# EAGLE design asomator5 (EAGLE 7.7.0)
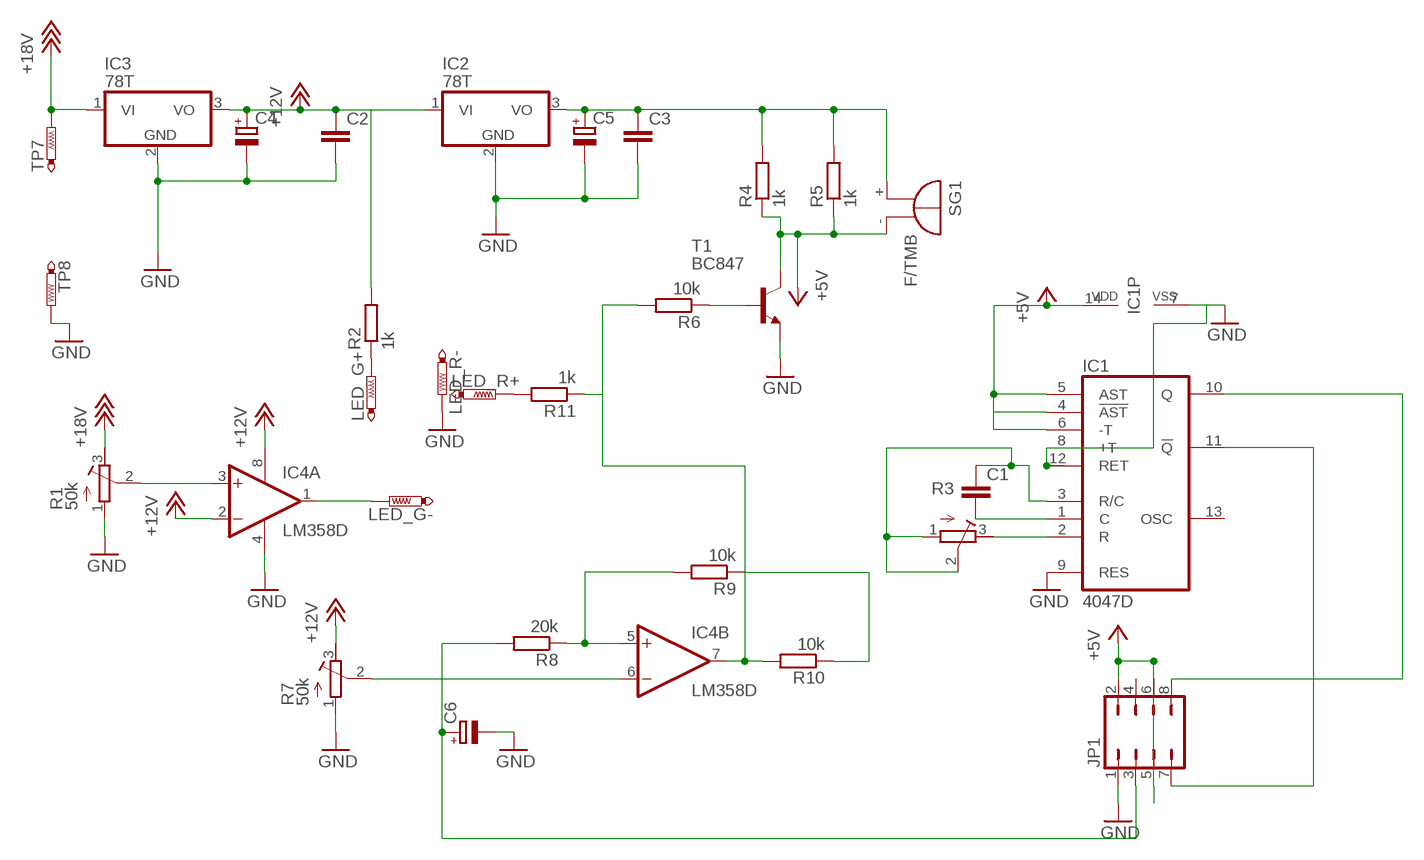
[diagram p0: schematic, sheet 1]

## Parts
C1  C-EUC1210  [C1210]
C2  C-EUC1210  [C1210]
C3  C-EUC1210  [C1210]
C4  CPOL-EUE2.5-7  [E2,5-7]
C5  CPOL-EUE2.5-7  [E2,5-7]
C6  CPOL-EUE2.5-7  [E2,5-7]
IC1  4047D  [SO14]
IC2  78T  7805T  [TO220H]
IC3  78T  7812T  [TO220H]
IC4  LM358D  [SO08]
JP1  JP4Q  [JP4Q]
LED_G+  PTR1PAD1-13Y  [P1-13Y]
LED_G-  PTR1PAD1-13Y  [P1-13Y]
LED_R+  PTR1PAD1-13Y  [P1-13Y]
LED_R-  PTR1PAD1-13Y  [P1-13Y]
R1  50k  R-TRIMM64W  [RTRIM64W]
R2  1k  R-EU_R1206  [R1206]
R3  R-TRIMM4G/J  [RTRIM4G/J]
R4  1k  R-EU_R1206  [R1206]
R5  1k  R-EU_R1206  [R1206]
R6  10k  R-EU_R1206  [R1206]
R7  50k  R-TRIMM64W  [RTRIM64W]
R8  20k  R-EU_R1206  [R1206]
R9  10k  R-EU_R1206  [R1206]
R10  10k  R-EU_R1206  [R1206]
R11  1k  R-EU_R1206  [R1206]
SG1  F/TMB  [F/TMB]
T1  BC847  [SOT23]
TP7  PTR1PAD1-13Y  [P1-13Y]
TP8  PTR1PAD1-13Y  [P1-13Y]

## Nets
+5V: IC1.4(!AST) IC1.5(AST) IC1.6(-T) IC1.14(VDD) JP1.2 JP1.5 JP1.6 R4.1 R5.1 SG1.- T1.3(C)
+12V: C2.1 C4.+ IC2.1(VI) IC3.3(VO) IC4.2(A:-IN) IC4.8(P:V+) R2.2 R7.3(E)
+18V: IC3.1(VI) R1.3(E) TP7.TP
GND: C2.2 C3.2 C4.- C5.- C6.- IC1.7(VSS) IC1.8(+T) IC1.9(RES) IC1.12(RET) IC2.2(GND) IC3.2(GND) IC4.4(P:V-) JP1.1 LED_R-.TP R1.1(A) R7.1(A) T1.2(E) TP8.TP
N$2: LED_G+.TP R2.1
N$3: LED_R+.TP R11.2
N$4: IC4.1(A:OUT) LED_G-.TP
N$5: IC4.3(A:+IN) R1.2(S)
N$6: IC4.7(B:OUT) R6.2 R10.2 R11.1
N$7: IC1.2(R) R3.3(E)
N$8: C1.2 IC1.1(C)
N$9: C1.1 IC1.3(R/C) R3.1(A) R3.2(S)
N$10: C3.1 C5.+ IC2.3(VO) R4.2 R5.2 SG1.+
N$12: IC1.10(Q) JP1.8
N$13: IC4.5(B:+IN) R8.1 R9.2
N$14: R9.1 R10.1
N$15: IC4.6(B:-IN) R7.2(S)
N$16: IC1.11(!Q) JP1.7
N$17: C6.+ JP1.3 R8.2
N$18: R6.1 T1.1(B)
Unconnected: IC1.13(OSC) JP1.4

## Library data of the parts
C1-C3 = rcl:C-EU: CAPACITOR, European symbol
C4-C6 = rcl:CPOL-EU: POLARIZED CAPACITOR, European symbol
IC1 = 40xx:4047: LP monostable/astable MULTIVIBRATOR
IC2 IC3 = linear:78*: Positive VOLTAGE REGULATOR Source: http://cache.national.com/ds/LM/LM78L05.pdf http://www.fairchildsemi.com/ds/LM/LM7805.pdf
IC4 = linear:LM358: OP AMP also LM158; LM258; LM2904 Source: http://cache.national.com/ds/LM/LM158.pdf
JP1 = jumper:JP4Q: JUMPER
LED_G+ LED_G- LED_R+ LED_R- TP7 TP8 = testpad:PTR1: TEST PIN
R1 R3 R7 = rcl:R-TRIMM: Trimm resistor
R2 R4-R6 R8-R11 = rcl:R-EU_: RESISTOR, European symbol
SG1 = buzzer:F/TMB: BUZZER Source: Buerklin; OC_FARNELL: unknown; OC_NEWARK: unknown
T1 = transistor:BC847: NPN TRANSISTOR

## Board
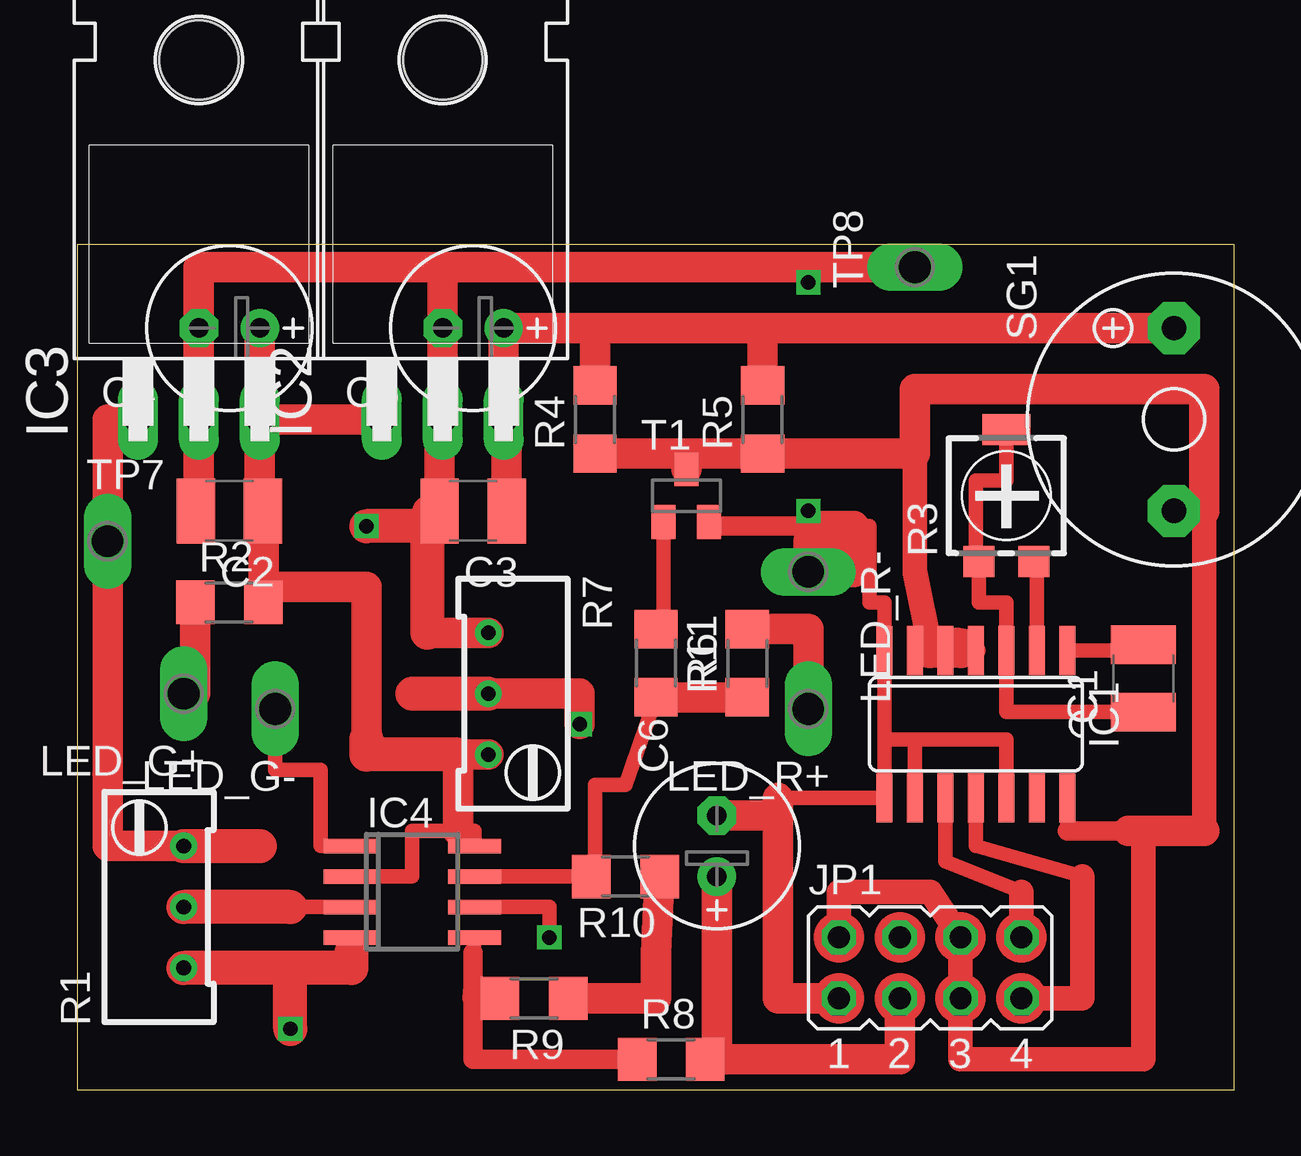
[diagram p1: board, top side]
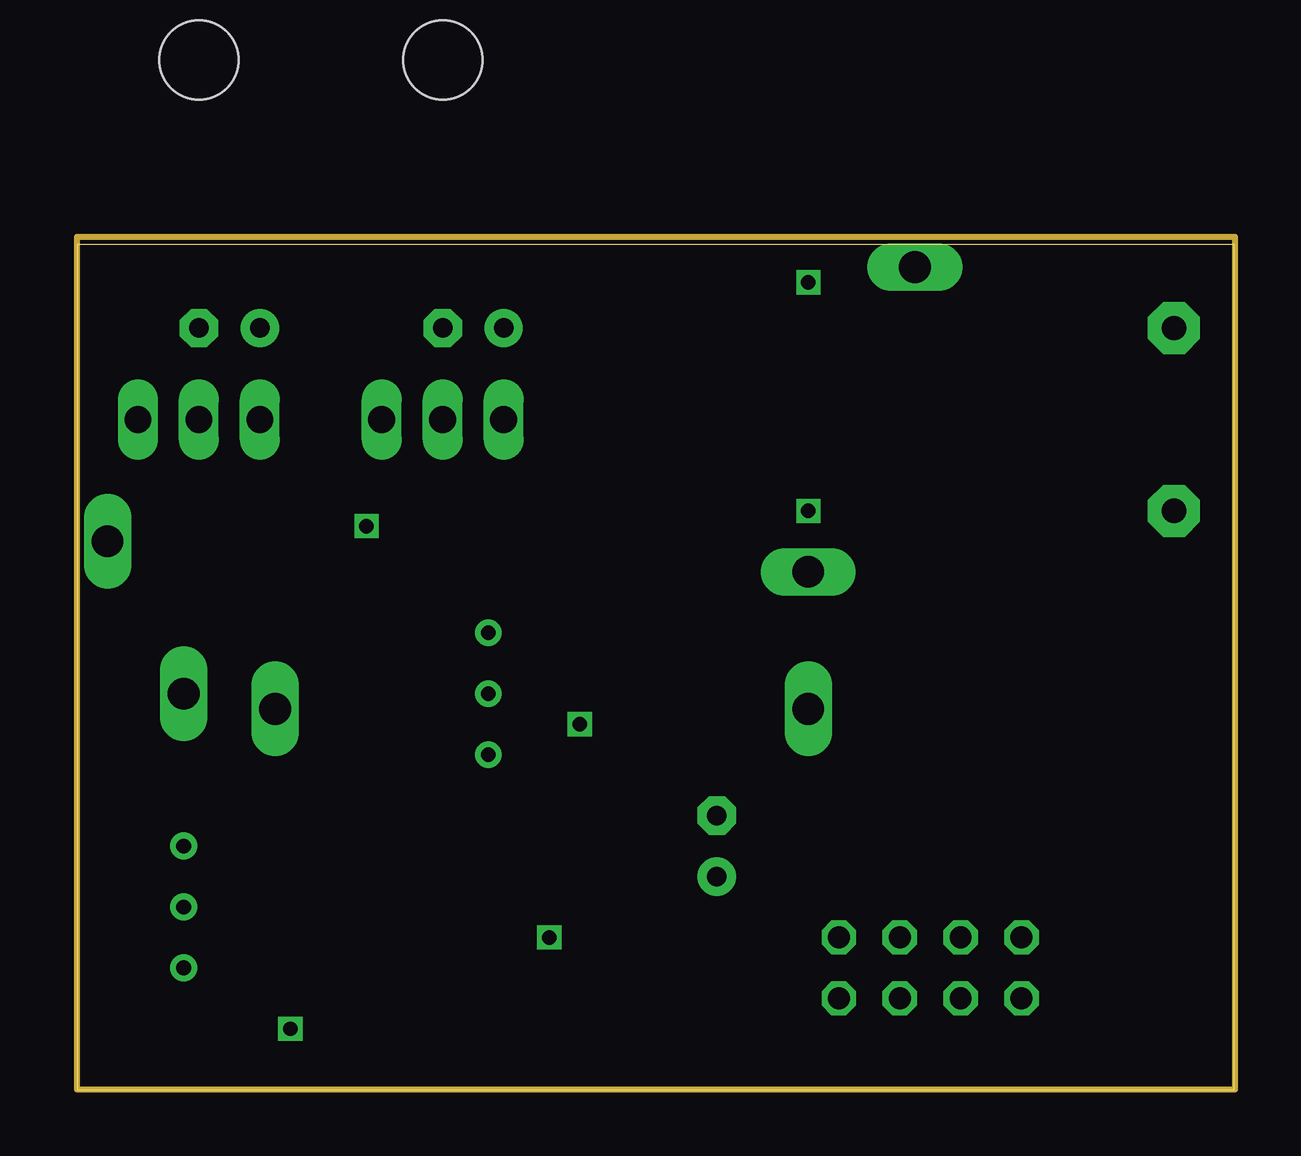
[diagram p2: board, inner layer Route2]
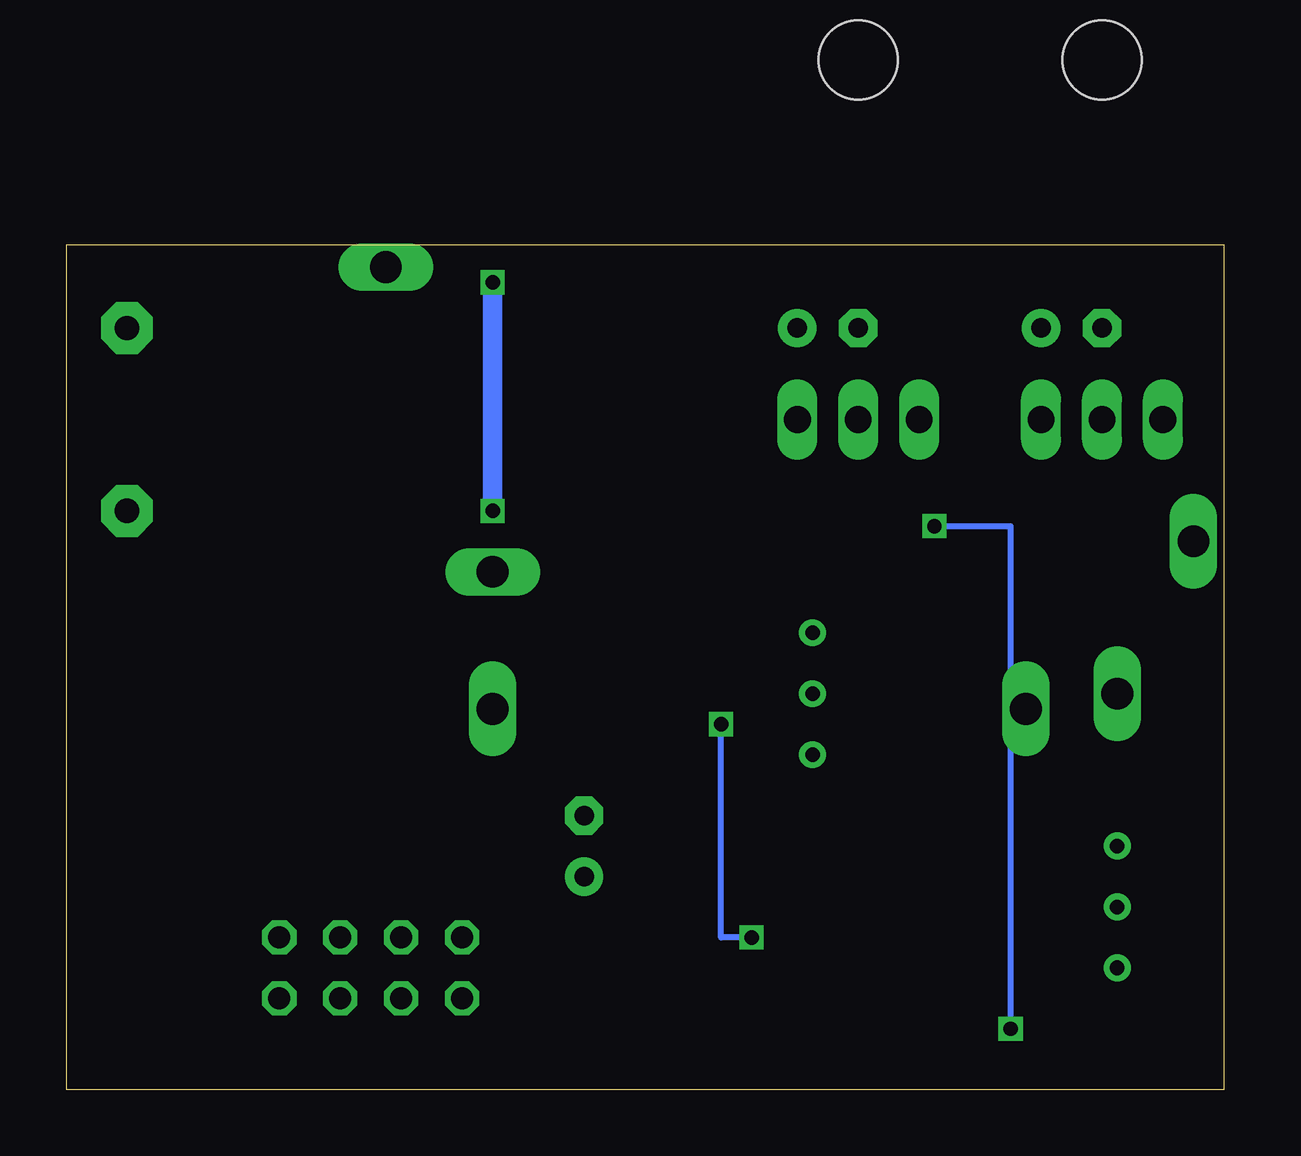
[diagram p3: board, bottom side, seen from below]

Size 48.24 x 35.23 mm. Coordinates in mm from the lower left corner, seen from the top.
Outline: 0,0 48.24,0 48.24,35.23 0,35.23 0,0
Copper layers (1*2*16): Top 0.035mm / dielectric 1.5mm / Route2 0.035mm / dielectric 0.15mm / Bottom 0.035mm
Design rules "default *": minimum track width 10mil, minimum drill 24mil, track to track 8mil, track to pad 8mil, pad to pad 8mil, via to via 8mil, smd to smd 8mil, copper to edge 40mil, drill to drill 8mil, minimum pad ring 10mil, minimum via ring 8mil, stop-mask expansion 4mil, vias tented up to drill 0mil, thermal gap 10mil

### Footprints (pad centres in the part's own frame; a part is rotated, then mirrored left to right if it is on the bottom)
C1210 = smd 1.6 x 2.7: 1 -1.4,0; 2 1.4,0
E2,5-7 = drill 0.813 pad 1.6: + -1.27,0 | drill 0.813 pad 1.6 octagon: - 1.27,0
SO14 = smd 0.66 x 2.032: 1 -3.81,-3.073; 2 -2.54,-3.073; 3 -1.27,-3.073; 4 0,-3.073; 5 1.27,-3.073; 6 2.54,-3.073; 7 3.81,-3.073; 8 3.81,3.073; 9 2.54,3.073; 10 1.27,3.073; 11 0,3.073; 12 -1.27,3.073; 13 -2.54,3.073; 14 -3.81,3.073
TO220H = drill 1.118 long: 1 -2.54,-10.16; 2 0,-10.16; 3 2.54,-10.16 | hole 3.302: 0,4.826
SO08 = smd 0.6 x 2.2: 1 -1.905,-2.6; 2 -0.635,-2.6; 3 0.635,-2.6; 4 1.905,-2.6; 5 1.905,2.6; 6 0.635,2.6; 7 -0.635,2.6; 8 -1.905,2.6
JP4Q = drill 0.914 octagon: 1 -3.81,-1.27; 2 -3.81,1.27; 3 -1.27,-1.27; 4 -1.27,1.27; 5 1.27,-1.27; 6 1.27,1.27; 7 3.81,-1.27; 8 3.81,1.27
P1-13Y = drill 1.321 pad 1.905 long: TP 0,0
RTRIM64W = drill 0.61: 1 1.27,-2.54; 2 1.27,0; 3 1.27,2.54
R1206 = smd 1.6 x 1.803: 1 -1.422,0; 2 1.422,0
RTRIM4G/J = smd 1.3 x 1.3: 1 -1.15,-2.75; 3 1.15,-2.75 | smd 2 x 1.3: 2 0,2.75
F/TMB = drill 1.016 pad 2.159 octagon: + 3.81,0; - -3.81,0
SOT23 = smd 1 x 1.4: 1 -0.95,-1.1; 2 0.95,-1.1; 3 0,1.1

### Placement (x,y rotation side)
C1  44.45,17.14 90 top
C2  6.35,24.13 180 top
C3  16.51,24.13 180 top
C4  6.35,31.75 180 top
C5  16.51,31.75 180 top
C6  26.67,10.16 90 top
IC1  37.47,15.24 180 top
IC2  15.24,38.1 0 top
IC3  5.08,38.1 0 top
IC4  13.97,8.26 270 top
JP1  35.56,5.08 0 top
LED_G+  4.45,16.51 180 top
LED_G-  8.26,15.88 180 top
LED_R+  30.48,15.88 180 top
LED_R-  30.48,21.59 270 top
R1  3.17,7.62 0 top
R2  6.35,20.32 0 top
R3  38.73,24.77 0 top
R4  21.59,27.94 90 top
R5  28.57,27.94 90 top
R6  24.13,17.78 270 top
R7  18.41,16.51 180 top
R8  24.77,1.27 0 top
R9  19.05,3.81 180 top
R10  22.86,8.89 180 top
R11  27.94,17.78 90 top
SG1  45.72,27.94 90 top
T1  25.4,24.77 0 top
TP7  1.27,22.86 0 top
TP8  34.92,34.29 90 top

### Tracks (layer width: path | path; a pad name or v marks a point on that pad's centre or on a via)
+5V
  Top 0.406: IC1.6 IC1.5 36.83,18.31
  Top 0.61: IC1.14 41.27,10.79
  Top 0.813: 41.27,10.79 43.81,10.79 44.45,10.79 | IC1.4 36.83,18.31 36.83,18.41
  Top 1.016: 44.45,10.79 44.45,1.27 36.83,1.27 JP1.5 JP1.6 35.56,8.26 31.75,8.26 JP1.2 | 46.99,24.13 46.99,10.79 | 35.56,18.41 34.92,21.59 34.92,29.21
  Top 1.27: SG1.- 46.99,24.13 46.99,29.21 34.92,29.21 34.92,26.52 R5.1 25.4,26.52 | 46.99,10.79 43.81,10.79 | R4.1 25.4,26.52 | 25.4,26.52 T1.3
  Top 1.676: 36.83,18.41 35.56,18.41
+12V
  Top 0.61: IC4.8 16.57,10.79 15.88,10.79 13.97,10.79 13.97,8.89 IC4.2
  Top 1.27: C4.+ IC3.3 | IC3.3 7.62,24.13 C2.1 7.77,24.13 7.77,20.95 | IC3.3 IC2.1 | R7.3 15.88,13.97 15.88,10.79 | 7.77,20.95 R2.2 | 12.06,14.61 12.06,20.95 7.77,20.95
  Top 1.422: 15.88,13.97 12.06,13.97 12.06,14.61
+18V
  Top 1.27: IC3.1 1.27,27.94 TP7.TP 1.27,10.16 R1.3
  Top 1.422: R1.3 7.62,10.16
GND  (via drill 0.6)
  Top 0.61: IC1.12 38.73,14.61 34.92,14.61 | 34.92,14.61 IC1.9 | 33.66,14.61 IC1.8 29.21,12.17 | 33.66,14.61 34.92,14.61 | 33.66,14.61 IC1.7 33.66,20.32 33.02,20.32 33.02,23.5 32.38,23.5 | IC4.4 11.43,6.35 11.43,5.71 | 26.35,23.5 T1.2
  Top 0.813: 26.35,23.5 30.48,23.5 v30.48,24.13 | v30.48,33.66 30.48,34.29
  Top 1.27: C2.2 5.08,24.13 IC3.2 C4.- 5.08,34.29 15.24,34.29 | 29.21,12.17 29.21,11.43 | 29.21,11.43 29.21,3.81 JP1.1 | 14.61,23.5 14.61,24.13 C3.2 15.11,27.94 IC2.2 C5.- 15.24,34.29 | 14.61,19.05 R7.1 | C6.- 29.21,11.43 | 15.24,34.29 30.48,34.29 TP8.TP | 30.48,22.86 LED_R-.TP 32.38,21.59 32.38,23.5 30.48,23.5
  Top 1.422: 11.43,5.71 11.43,5.08 8.89,5.08 | 8.89,5.08 R1.1 | 14.61,19.05 14.61,23.5 v12.06,23.5 | v8.89,2.54 8.89,5.08
  Bottom 0.254: v12.06,23.5 8.89,23.5 v8.89,2.54
  Bottom 0.813: v30.48,24.13 v30.48,33.66
N$1
  Top 1.27: 31.11,22.86 31.75,22.86 31.75,22.23 31.11,22.23
N$2
  Top 1.27: LED_G+.TP 4.93,16.51 R2.1
N$3
  Top 1.27: R11.2 30.48,19.2 LED_R+.TP
N$4
  Top 0.61: IC4.1 10.16,10.16 10.16,13.34 8.26,13.34 LED_G-.TP
N$5
  Top 0.61: IC4.3 8.89,7.62
  Top 1.422: 8.89,7.62 R1.2
N$6
  Top 0.61: IC4.7 R10.2 21.59,9.53 21.59,12.7 22.86,12.7 R6.2
  Top 1.27: R6.2 R11.1
N$7
  Top 0.61: IC1.2 40.01,21.59 39.88,21.59 R3.3
N$8
  Top 0.61: IC1.1 44.45,18.31 C1.2
N$9
  Top 0.61: C1.1 38.73,15.74 IC1.3 38.73,20.32 37.59,20.32 R3.1 37.47,22.02 37.47,25.4 38.73,25.4 R3.2
N$10
  Top 1.27: C3.1 17.91,27.94 IC2.3 C5.+ 21.59,31.75 | 21.59,31.75 28.57,31.75 | 28.57,31.75 SG1.+ | R5.2 28.57,31.75 | R4.2 21.59,31.75
N$11
  Route2 0.254: 0,0 0,35.56 48.26,35.56 48.26,0 0,0
N$12
  Top 0.61: 39.37,8.26 36.2,9.53 IC1.10
  Top 1.016: JP1.8 39.37,8.26
N$13
  Top 0.61: R9.2 16.36,3.81 IC4.5 16.51,5.71
  Top 0.813: R8.1 16.51,1.27 16.51,5.71
N$14
  Top 1.27: R9.1 24.13,3.81 24.13,5.71 R10.1
N$15  (via drill 0.6)
  Top 0.61: IC4.6 19.68,7.62 v19.68,6.35
  Top 1.27: v20.95,15.24 20.95,16.51 R7.2
  Top 1.422: 13.97,16.51 R7.2
  Bottom 0.254: v19.68,6.35 20.95,6.35 v20.95,15.24
N$16
  Top 0.61: 41.91,8.89 37.47,10.16 IC1.11
  Top 1.016: JP1.7 41.91,3.81 41.91,8.89
N$17
  Top 1.27: JP1.3 34.29,1.27 R8.2 26.67,1.27 C6.+
N$18
  Top 0.61: R6.1 24.45,19.2 T1.1
(copper drawn outside any net)
  shapes: Top circle x8